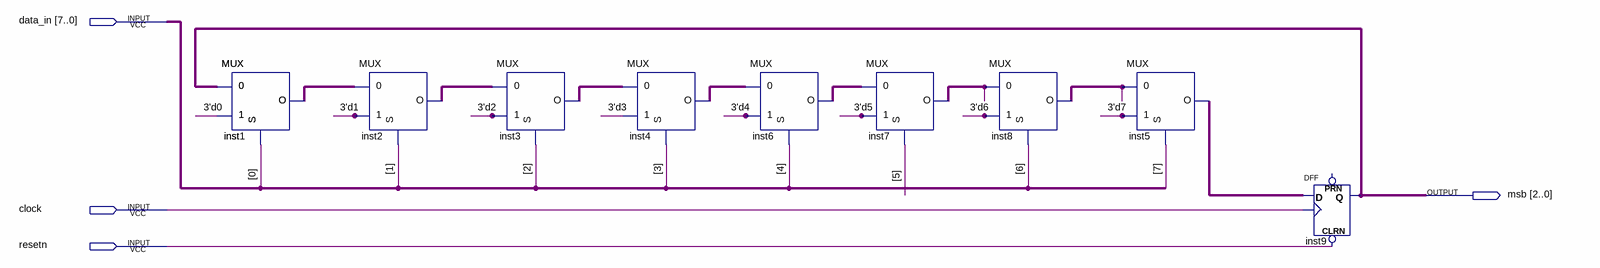
[diagram p0: schematic sheet]
// Quartus schematic Q5.bdf as structural Verilog: 10 symbols, 4 pins
module Q5 (
  input  [7:0] data_in,
  input  clock,
  input  resetn,
  output [2:0] msb
);

  wire \3'd0 , \3'd1 , \3'd2 , \3'd3 , \3'd4 , \3'd5 , \3'd6 , \3'd7 , inst2_o, inst3_o, inst4_o, inst6_o,
       inst7_o, inst8_o, inst_o, undriven, undriven_2, undriven_3, undriven_4, undriven_5, undriven_6,
       undriven_7, undriven_8;
  wire [2:0] inst5_o;

  MUX inst (.\0 (msb), .\1 (\3'd0 ), .S(undriven), .O(inst_o));
  MUX inst1 (.\0 (msb), .\1 (\3'd0 ), .S(undriven), .O(inst_o));
  MUX inst2 (.\0 (inst_o), .\1 (\3'd1 ), .S(undriven_2), .O(inst2_o));
  MUX inst3 (.\0 (inst2_o), .\1 (\3'd2 ), .S(undriven_3), .O(inst3_o));
  MUX inst4 (.\0 (inst3_o), .\1 (\3'd3 ), .S(undriven_4), .O(inst4_o));
  MUX inst6 (.\0 (inst4_o), .\1 (\3'd4 ), .S(undriven_5), .O(inst6_o));
  MUX inst7 (.\0 (inst6_o), .\1 (\3'd5 ), .S(undriven_6), .O(inst7_o));
  MUX inst8 (.\0 (inst7_o), .\1 (\3'd6 ), .S(undriven_7), .O(inst8_o));
  MUX inst5 (.\0 (inst8_o), .\1 (\3'd7 ), .S(undriven_8), .O(inst5_o));
  DFF inst9[2:0] (.CLRN(resetn), .CLK(clock), .D(inst5_o), .Q(msb));  // open: PRN
endmodule
